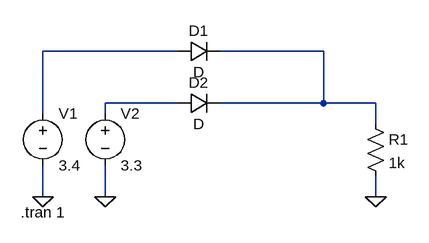
[diagram p0: schematic Diode Protection System.asc]
Diode Protection System.asc, the LTspice schematic file:
Version 4
SHEET 1 880 680
WIRE 112 96 -96 96
WIRE 336 96 176 96
WIRE 112 176 0 176
WIRE 336 176 336 96
WIRE 336 176 176 176
WIRE 416 176 336 176
WIRE -96 192 -96 96
WIRE 0 192 0 176
WIRE 416 208 416 176
WIRE -96 320 -96 272
WIRE 0 320 0 272
WIRE 416 320 416 288
FLAG -96 320 0
FLAG 0 320 0
FLAG 416 320 0
SYMBOL diode 112 112 R270
WINDOW 0 32 32 VTop 2
WINDOW 3 0 32 VBottom 2
SYMATTR InstName D1
SYMBOL diode 112 192 R270
WINDOW 0 32 32 VTop 2
WINDOW 3 0 32 VBottom 2
SYMATTR InstName D2
SYMBOL voltage -96 176 R0
WINDOW 123 0 0 Left 0
WINDOW 39 0 0 Left 0
SYMATTR InstName V1
SYMATTR Value 3.4
SYMBOL voltage 0 176 R0
WINDOW 123 0 0 Left 0
WINDOW 39 0 0 Left 0
SYMATTR InstName V2
SYMATTR Value 3.3
SYMBOL res 400 192 R0
SYMATTR InstName R1
SYMATTR Value 1k
TEXT -130 344 Left 2 !.tran 1

The netlist it stands for:
* Diode Protection System.asc
D1 N001 N002 D
D2 N003 N002 D
V1 N001 0 3.4
V2 N003 0 3.3
R1 N002 0 1k
.model D D
.lib standard.dio
.tran 1
.backanno
.end